# EAGLE design load (EAGLE 7.6.0)
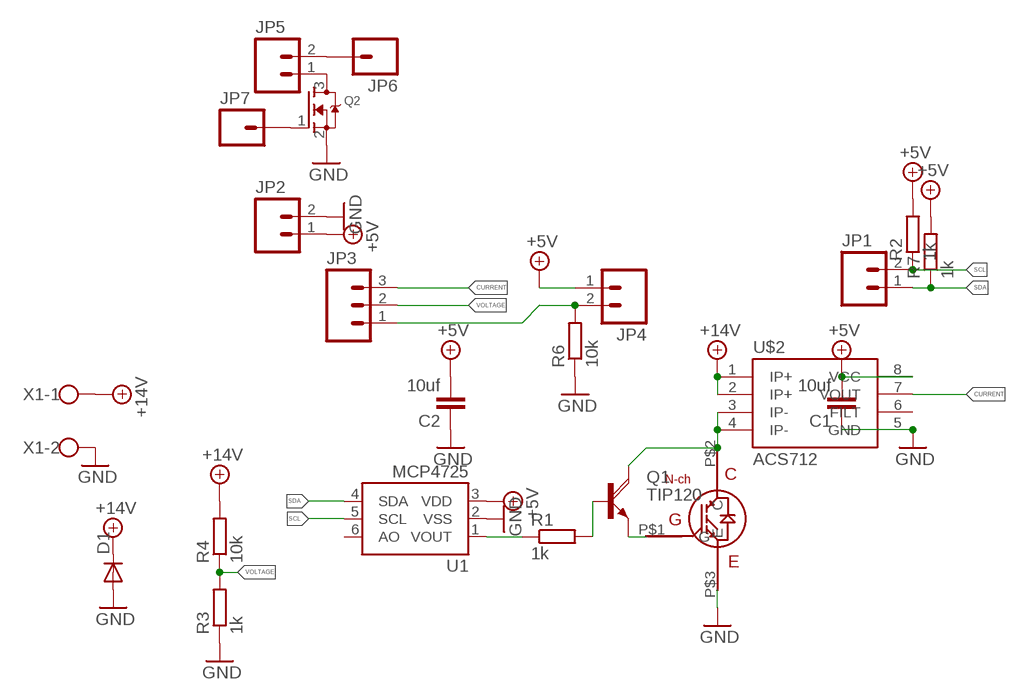
[diagram p0: schematic, sheet 1]

## Parts
C1  10uf  C-EUC0603  [C0603]
C2  10uf  C-EUC0603  [C0603]
D1  DIODE-TO220V  [TO220ACS]
JP1  M02PTH  [1X02]
JP2  M02PTH  [1X02]
JP3  M03PTH  [1X03]
JP4  M02PTH  [1X02]
JP5  M02PTH  [1X02]
JP6  M01PTH  [1X01]
JP7  M01PTH  [1X01]
Q1  TIP120  [TO220AH]
Q2  MOSFET-NREFLOW  [SOT23]
R1  1k  R-EU_R0603  [R0603]
R2  1k  R-EU_R0603  [R0603]
R3  1k  R-EU_R0603  [R0603]
R4  10k  R-EU_R0603  [R0603]
R6  10k  R-EU_R0603  [R0603]
R7  1k  R-EU_R0603  [R0603]
U1  MCP4725  MCP4725SOT-23  [SOT23-6]
U$1  TO-247A  [TO-247]
U$2  ACS712  [SO08]
X1  W237-102  [W237-102]

## Nets
+5V: C1.2 C2.2 JP2.1 JP4.1 R2.2 R7.2 U1.3(VDD) U$2.8(VCC)
+14V: D1.C R4.2 U$2.1(IP+) U$2.2(IP+) X1.1
CURRENT: JP3.3 U$2.7(VOUT)
GND: C1.1 C2.1 D1.A JP2.2 Q2.2(S) R3.1 R6.1 U1.2(VSS) U$1.P$3(E) U$2.5(GND) X1.2
N$1: Q1.E U$1.P$1(G)
N$2: JP7.1 Q2.1(G)
N$3: JP5.1 Q2.3(D)
N$4: JP5.2 JP6.1
N$6: R1.1 U1.1(VOUT)
N$7: Q1.B R1.2
N$8: Q1.C U$1.P$2(C) U$2.3(IP-) U$2.4(IP-)
SCL: JP1.2 R2.1 U1.5(SCL)
SDA: JP1.1 R7.1 U1.4(SDA)
THERM: JP3.1 JP4.2 R6.2
VOLTAGE: JP3.2 R3.2 R4.1
Unconnected: U1.6(AO) U$2.6(FILT)

## Library data of the parts
C1 C2 = rcl:C-EU: CAPACITOR, European symbol
D1 = diode:DIODE-: DIODE
JP1 JP2 JP4 JP5 = SparkFun-Connectors:M02: Standard 2-pin 0.1" header. Use with - straight break away headers ( PRT-00116) - right angle break away headers (PRT-00553) - swiss pins (PRT-00743) - machine pins (PRT-00117) - female headers (PRT-00115) Molex polarized connector foot print use with: PRT-08233 with associated crimp pins and housings. 2.54_SCREWTERM for use with PRT-10571. 3.5mm Screw Terminal footprints for PRT-08084 5mm Screw Terminal footprints for use with PRT-08432
JP3 = SparkFun-Connectors:M03: Header 3 Standard 3-pin 0.1" header. Use with straight break away headers (SKU : PRT-00116), right angle break away headers (PRT-00553), swiss pins (PRT-00743), machine pins (PRT-00117), and female headers (PRT-00115). Molex polarized connector foot print use with SKU : PRT-08232 with associated crimp pins and housings.
JP6 JP7 = SparkFun-Connectors:M01: Header 1 Standard 1-pin 0.1" header. Use with straight break away headers (SKU : PRT-00116), right angle break away headers (PRT-00553), swiss pins (PRT-00743), machine pins (PRT-00117), and female headers (PRT-00115).
Q1 = transistor-power:TIP120: NPN DARLINGTON TRANSISTOR
Q2 = adafruit:MOSFET-N: N-Channel Mosfet 2N7002E - 60V 260mA SOT23 [Digikey: 2N7002ET1GOSTR-ND] - REEL BSH103 - 30V 850mA SOT23 [Digikey: 568-5013-1-ND]
R1-R4 R6 R7 = rcl:R-EU_: RESISTOR, European symbol
U1 = SparkFun-AnalogIC:MCP4725: Microchip 12-bit I2C DAC, SOT23-6; PROD_ID: IC-08886
U$1 = to-247_n-channel_igbt (1):TO-247
U$2 = SparkFun-AnalogIC:ACS712: Hall-effect-based isolated linear current sensor; PROD_ID: IC-08964
X1 = con-wago-500:W237-102: WAGO SCREW CLAMP; MPN: 237-102; OC_FARNELL: unknown; OC_NEWARK: 70K9898

## Net classes
0 default: width 0.508 mm

## Board
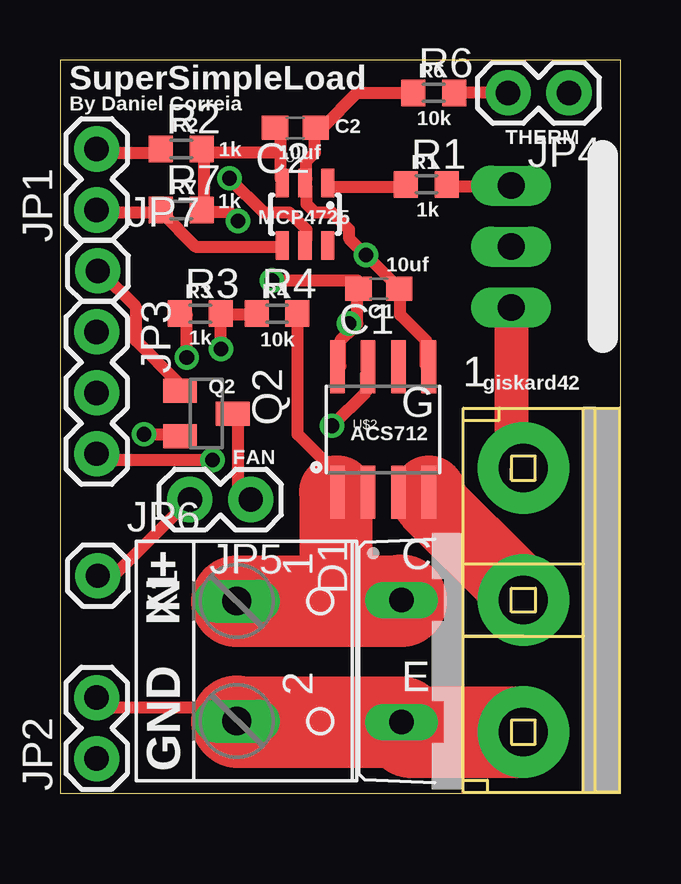
[diagram p1: board, top side]
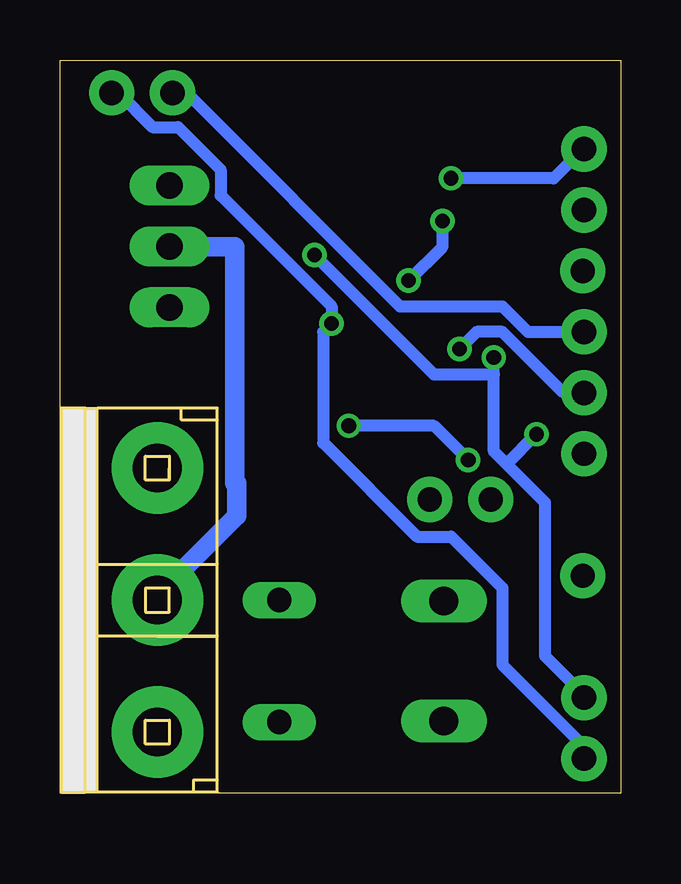
[diagram p2: board, bottom side, seen from below]

Size 23.36 x 30.56 mm. Coordinates in mm from the lower left corner, seen from the top.
Outline: 0,30.56 0,0 23.36,0 23.36,30.56 0,30.56
Copper layers (1*16): Top 0.035mm / dielectric 1.5mm / Bottom 0.035mm
Design rules "default": minimum track width 10mil, minimum drill 24mil, track to track 8mil, track to pad 8mil, pad to pad 8mil, via to via 8mil, smd to smd 8mil, copper to edge 40mil, drill to drill 8mil, minimum pad ring 10mil, minimum via ring 8mil, stop-mask expansion 4mil, vias tented up to drill 0mil, thermal gap 10mil

### Footprints (pad centres in the part's own frame; a part is rotated, then mirrored left to right if it is on the bottom)
C0603 = smd 1.1 x 1: 1 -0.85,0; 2 0.85,0
TO220ACS = drill 1.016 long: A 2.54,-2.54; C -2.54,-2.54
1X02 = drill 1.016 pad 1.88: 1 0,0; 2 2.54,0
1X03 = drill 1.016 pad 1.88: 1 0,0; 2 2.54,0; 3 5.08,0
1X01 = drill 1.016 pad 1.88: 1 0,0
TO220AH = drill 1.118 long: B -2.54,-6.35; C 0,-6.35; E 2.54,-6.35
SOT23 = smd 1 x 1.4: 1 -0.95,-1.1; 2 0.95,-1.1; 3 0,1.1
R0603 = smd 1 x 1.1: 1 -0.85,0; 2 0.85,0
SOT23-6 = smd 0.55 x 1.2: 1 0.95,1.3; 2 0,1.3; 3 -0.95,1.3; 4 -0.95,-1.3; 5 0,-1.3; 6 0.95,-1.3
TO-247 = drill 2.032 pad 3.81: P$1 0,5.5; P$2 0,0; P$3 0,-5.5
SO08 = smd 0.61 x 2.21: 1 -1.905,-2.616; 2 -0.635,-2.616; 3 0.635,-2.616; 4 1.905,-2.616; 5 1.905,2.616; 6 0.635,2.616; 7 -0.635,2.616; 8 -1.905,2.616
W237-102 = drill 1.194 long: 1 -2.5,-1.27; 2 2.5,-1.27

### Placement (x,y rotation side)
C1  13.28,21.03 180 top
C2  9.8,27.74 180 top
D1  16.76,5.51 270 top
JP1  1.52,24.31 90 top
JP2  1.52,1.45 90 top
JP3  1.52,19.23 270 top
JP4  21.21,29.18 180 top
JP5  7.95,12.24 180 top
JP6  1.57,9.07 0 top
JP7  1.57,21.77 0 top
Q1  25.15,22.78 270 top
Q2  6.1,15.82 270 top
R1  15.27,25.37 0 top
R2  5.05,26.85 0 top
R3  5.84,19.99 0 top
R4  9.04,19.99 0 top
R6  15.57,29.18 0 top
R7  5.05,24.31 0 top
U1  10.21,24.13 0 top
U$1  19.3,8.05 0 top
U$2  13.46,15.16 0 top
X1  8.64,5.51 270 top

### Tracks (layer width: path | path; a pad name or v marks a point on that pad's centre or on a via)
+5V  (via drill 0.61)
  Top 0.508: 5.99,26.7 5.99,24.56 R7.2 5.99,24.21 7.06,24.21 v7.42,23.85 | 9.2,26.7 9.2,25.63 U1.3 | 9.2,26.7 9.2,27.41 C2.2 | 9.2,26.7 5.99,26.7 | 5.99,26.7 R2.2 | 12.22,19.41 11.68,18.87 11.68,17.81 U$2.8 | 12.22,19.41 12.4,19.58 12.4,21.01 C1.2 12.4,21.36 v8.84,21.36 | v12.04,19.58 12.22,19.41
  Bottom 0.508: JP4.1 20.93,29.18 19.51,27.76 18.44,27.76 16.66,25.98 16.66,24.92 12.04,20.29 v12.04,19.58 12.4,19.23 12.4,14.61 8.48,10.69 7.06,10.69 4.93,8.56 4.93,5.36 1.73,2.16 1.73,1.45 JP2.1 | v7.42,23.85 7.42,22.78 v8.84,21.36
+14V
  Top 0.508: R4.2 9.91,19.94 9.91,14.96 10.97,13.89 11.48,12.55 12.75,12.83 U$2.2
  Top 3.048: U$2.1 11.48,12.55 11.48,8.01
  Top 3.81: X1.1 11.48,8.01 14.22,8.01 D1.C
CURRENT  (via drill 0.61)
  Top 0.508: v11.33,15.32 12.75,16.74 12.75,17.45 U$2.7 | v6.35,13.89 1.73,13.89 JP3.3
  Bottom 0.508: v11.33,15.32 7.77,15.32 v6.35,13.89
GND  (via drill 0.61)
  Top 0.508: U$2.5 15.24,17.81 15.24,18.87 14.17,19.94 14.17,21.01 C1.1 13.82,21.36 v12.75,22.43 12.04,23.14 12.04,23.5 11.33,24.21 10.62,24.21 10.26,24.56 10.26,25.27 U1.2 10.26,25.63 10.26,26.34 10.62,26.7 10.62,27.41 C2.1 10.97,27.76 12.4,29.18 R6.1 | v5.28,18.16 5.28,19.94 R3.1 | v3.51,14.96 4.93,14.96 Q2.2 | X1.2 5.64,3.58 2.08,3.58 1.73,3.94 JP2.2
  Top 3.81: U$1.P$3 14.64,2.55 D1.A 7.41,2.97 X1.2
  Bottom 0.508: 5.28,17.45 5.28,14.25 4.75,13.72 | 5.28,17.45 v5.28,18.16 | 4.75,13.72 3.15,12.12 3.15,5.71 1.73,4.29 JP2.2 | 4.75,13.72 v3.51,14.96 | v12.75,22.43 7.77,17.45 5.28,17.45
N$1
  Top 1.422: Q1.E 18.8,14.06 U$1.P$1
N$2
  Top 0.508: Q2.1 4.93,17.09 3.15,18.87 3.15,20.29 1.73,21.72 JP7.1
N$3
  Top 0.508: Q2.3 7.42,15.67 7.42,12.83 7.77,12.47 JP5.1
N$4
  Top 0.508: JP5.2 2.44,9.27 1.73,9.27 JP6.1
N$6
  Top 0.508: R1.1 14.17,25.27 11.33,25.27 U1.1
N$7
  Top 0.508: R1.2 16.31,25.27 18.8,25.27 Q1.B
N$8
  Top 0.508: U$2.3 14.17,12.83 15.37,12.19
  Top 3.048: U$2.4 15.37,12.19 18.9,8.66 18.9,8.46 U$1.P$2
  Bottom 0.813: Q1.C 16.08,22.78 16.08,12.93 15.99,12.93 15.99,11.57 18.8,8.76 18.8,8.56 U$1.P$2
SCL  (via drill 0.61)
  Top 0.508: R2.1 3.86,26.7 1.73,26.7 JP1.2 | v7.06,25.63 8.48,24.21 9.55,24.21 10.26,23.5 10.26,23.14 U1.5
  Bottom 0.508: v7.06,25.63 2.79,25.63 1.73,26.7 JP1.2
SDA
  Top 0.508: JP1.1 1.73,24.21 3.86,24.21 R7.1 4.22,24.21 5.64,22.78 9.2,22.78 U1.4
THERM
  Top 0.508: JP4.2 R6.2
  Bottom 0.508: JP3.1 3.86,19.23 4.93,20.29 9.2,20.29 18.09,29.18 JP4.2
VOLTAGE  (via drill 0.61)
  Top 0.508: 6.71,19.94 8.13,19.94 R4.1 | v6.71,18.52 6.71,19.94 | 6.71,19.94 R3.2
  Bottom 0.508: v6.71,18.52 5.99,19.23 4.93,19.23 2.44,16.74 1.73,16.74 JP3.2

### Text on the board
_tsilk: SuperSimpleLoad | R6 | By Daniel Correia | C2 | R2 | 10k | 1k | 10uf | THERM | R1 | R7 | 1k | MCP4725 | 1k | 10uf | R3 | R4 | C1 | 1k | 10k | Q2 | giskard42 | ACS712 | FAN | IN+ | GND